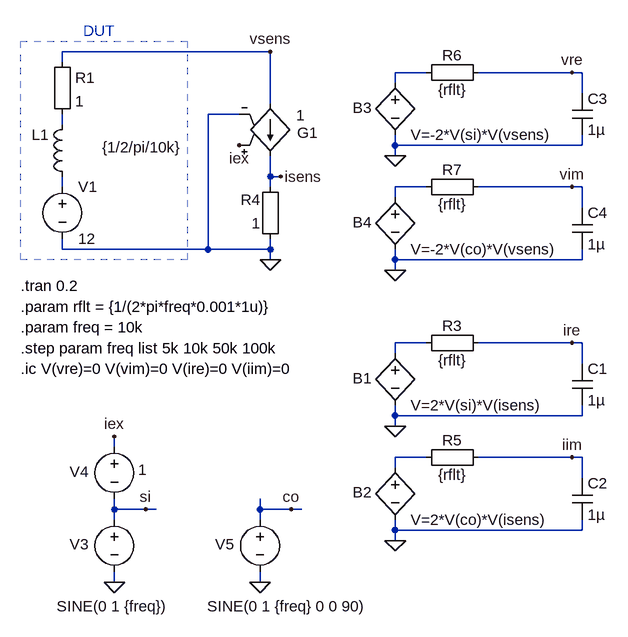
[diagram p0: schematic zmeas.asc]
zmeas.asc, the LTspice schematic file:
Version 4
SHEET 1 880 680
WIRE 80 -592 -240 -592
WIRE -240 -576 -240 -592
WIRE 320 -560 272 -560
WIRE 544 -560 400 -560
WIRE 560 -560 544 -560
WIRE 272 -544 272 -560
WIRE 560 -528 560 -560
WIRE 80 -512 80 -592
WIRE 32 -496 -16 -496
WIRE -240 -480 -240 -496
WIRE 272 -448 272 -464
WIRE 560 -448 560 -464
WIRE 560 -448 272 -448
WIRE 272 -432 272 -448
WIRE 80 -400 80 -432
WIRE 96 -400 80 -400
WIRE -240 -384 -240 -400
WIRE 80 -384 80 -400
WIRE 320 -384 272 -384
WIRE 544 -384 400 -384
WIRE 560 -384 544 -384
WIRE 272 -368 272 -384
WIRE 560 -352 560 -384
WIRE -240 -288 -240 -304
WIRE -16 -288 -16 -496
WIRE -16 -288 -240 -288
WIRE 80 -288 80 -304
WIRE 80 -288 -16 -288
WIRE 80 -272 80 -288
WIRE 272 -272 272 -288
WIRE 560 -272 560 -288
WIRE 560 -272 272 -272
WIRE 272 -256 272 -272
WIRE 320 -144 272 -144
WIRE 544 -144 400 -144
WIRE 560 -144 544 -144
WIRE 272 -128 272 -144
WIRE 560 -112 560 -144
WIRE 272 -32 272 -48
WIRE 560 -32 560 -48
WIRE 560 -32 272 -32
WIRE 272 -16 272 -32
WIRE -160 16 -160 0
WIRE 320 32 272 32
WIRE 544 32 400 32
WIRE 560 32 544 32
WIRE 272 48 272 32
WIRE 560 64 560 32
WIRE -160 112 -160 96
WIRE -112 112 -160 112
WIRE -96 112 -112 112
WIRE 64 112 64 96
WIRE 112 112 64 112
WIRE 128 112 112 112
WIRE -160 128 -160 112
WIRE 64 128 64 112
WIRE 272 144 272 128
WIRE 560 144 560 128
WIRE 560 144 272 144
WIRE 272 160 272 144
WIRE -160 224 -160 208
WIRE 64 224 64 208
FLAG 80 -272 0
FLAG -160 224 0
FLAG -160 0 iex
FLAG 32 -448 iex
FLAG -112 112 si
FLAG 64 224 0
FLAG 112 112 co
FLAG 272 -16 0
FLAG 80 -592 vsens
FLAG 96 -400 isens
FLAG 272 160 0
FLAG 544 -144 ire
FLAG 544 32 iim
FLAG 272 -432 0
FLAG 272 -256 0
FLAG 544 -560 vre
FLAG 544 -384 vim
SYMBOL voltage -240 -400 R0
SYMATTR InstName V1
SYMATTR Value 12
SYMBOL g 80 -416 M180
WINDOW 0 41 51 Left 2
WINDOW 3 40 78 Left 2
SYMATTR InstName G1
SYMATTR Value 1
SYMBOL Misc\\EuropeanResistor -256 -592 R0
SYMATTR InstName R1
SYMATTR Value 1
SYMBOL voltage -160 0 R0
WINDOW 0 -69 54 Left 2
WINDOW 3 37 51 Left 2
WINDOW 123 0 0 Left 0
WINDOW 39 0 0 Left 0
SYMATTR InstName V4
SYMATTR Value 1
SYMBOL voltage -160 112 R0
WINDOW 0 -69 54 Left 2
WINDOW 3 -89 149 Left 2
WINDOW 123 0 0 Left 0
WINDOW 39 0 0 Left 0
SYMATTR InstName V3
SYMATTR Value SINE(0 1 {freq})
SYMBOL voltage 64 112 R0
WINDOW 0 -69 54 Left 2
WINDOW 3 -81 149 Left 2
WINDOW 123 0 0 Left 0
WINDOW 39 0 0 Left 0
SYMATTR InstName V5
SYMATTR Value SINE(0 1 {freq} 0 0 90)
SYMBOL bv 272 -144 R0
WINDOW 0 -65 54 Left 2
SYMATTR InstName B1
SYMATTR Value V=2*V(si)*V(isens)
SYMBOL cap 544 -112 R0
SYMATTR InstName C1
SYMATTR Value 1µ
SYMBOL Misc\\EuropeanResistor 416 -160 R90
WINDOW 0 5 56 VBottom 2
WINDOW 3 27 56 VTop 2
SYMATTR InstName R3
SYMATTR Value {rflt}
SYMBOL Misc\\EuropeanResistor 96 -288 R180
WINDOW 0 31 76 Left 2
WINDOW 3 31 40 Left 2
SYMATTR InstName R4
SYMATTR Value 1
SYMBOL bv 272 32 R0
WINDOW 0 -65 54 Left 2
SYMATTR InstName B2
SYMATTR Value V=2*V(co)*V(isens)
SYMBOL cap 544 64 R0
SYMATTR InstName C2
SYMATTR Value 1µ
SYMBOL Misc\\EuropeanResistor 416 16 R90
WINDOW 0 5 56 VBottom 2
WINDOW 3 27 56 VTop 2
SYMATTR InstName R5
SYMATTR Value {rflt}
SYMBOL bv 272 -560 R0
WINDOW 0 -65 54 Left 2
SYMATTR InstName B3
SYMATTR Value V=-2*V(si)*V(vsens)
SYMBOL cap 544 -528 R0
SYMATTR InstName C3
SYMATTR Value 1µ
SYMBOL Misc\\EuropeanResistor 416 -576 R90
WINDOW 0 5 56 VBottom 2
WINDOW 3 27 56 VTop 2
SYMATTR InstName R6
SYMATTR Value {rflt}
SYMBOL bv 272 -384 R0
WINDOW 0 -65 54 Left 2
SYMATTR InstName B4
SYMATTR Value V=-2*V(co)*V(vsens)
SYMBOL cap 544 -352 R0
SYMATTR InstName C4
SYMATTR Value 1µ
SYMBOL Misc\\EuropeanResistor 416 -400 R90
WINDOW 0 5 56 VBottom 2
WINDOW 3 27 56 VTop 2
SYMATTR InstName R7
SYMATTR Value {rflt}
SYMBOL ind -224 -384 R180
WINDOW 0 36 80 Left 2
WINDOW 3 -167 61 Left 2
SYMATTR InstName L1
SYMATTR Value {1/2/pi/10k}
SYMATTR SpiceLine Rser=0
TEXT -304 -232 Left 2 !.tran 0.2
TEXT -304 -168 Left 2 !.param freq = 10k
TEXT -304 -136 Left 2 !.step param freq list 5k 10k 50k 100k
TEXT -304 -200 Left 2 !.param rflt = {1/(2*pi*freq*0.001*1u)}
TEXT -208 -624 Left 2 ;DUT
TEXT -304 -104 Left 2 !.ic V(vre)=0 V(vim)=0 V(ire)=0 V(iim)=0
LINE Normal -304 -272 -304 -608 2
LINE Normal -48 -272 -304 -272 2
LINE Normal -48 -608 -48 -272 2
LINE Normal -304 -608 -48 -608 2

The netlist it stands for:
* zmeas.asc
V1 N003 0 12
G1 vsens isens iex 0 1
R1 vsens N002 1
V4 iex si 1
V3 si 0 SINE(0 1 {freq})
V5 co 0 SINE(0 1 {freq} 0 0 90)
B1 N005 0 V=2*V(si)*V(isens)
C1 ire 0 1µ
R3 ire N005 {rflt}
R4 0 isens 1
B2 N006 0 V=2*V(co)*V(isens)
C2 iim 0 1µ
R5 iim N006 {rflt}
B3 N001 0 V=-2*V(si)*V(vsens)
C3 vre 0 1µ
R6 vre N001 {rflt}
B4 N004 0 V=-2*V(co)*V(vsens)
C4 vim 0 1µ
R7 vim N004 {rflt}
L1 N003 N002 {1/2/pi/10k} Rser=0
.tran 0.2
.param freq = 10k
.step param freq list 5k 10k 50k 100k
.param rflt = {1/(2*pi*freq*0.001*1u)}
* DUT
.ic V(vre)=0 V(vim)=0 V(ire)=0 V(iim)=0
.backanno
.end